# Altium schematic sheet caton-d-q100.SchDoc: Caton-D-Q100
size A4; SheetNumber: 1; SheetTotal: 1
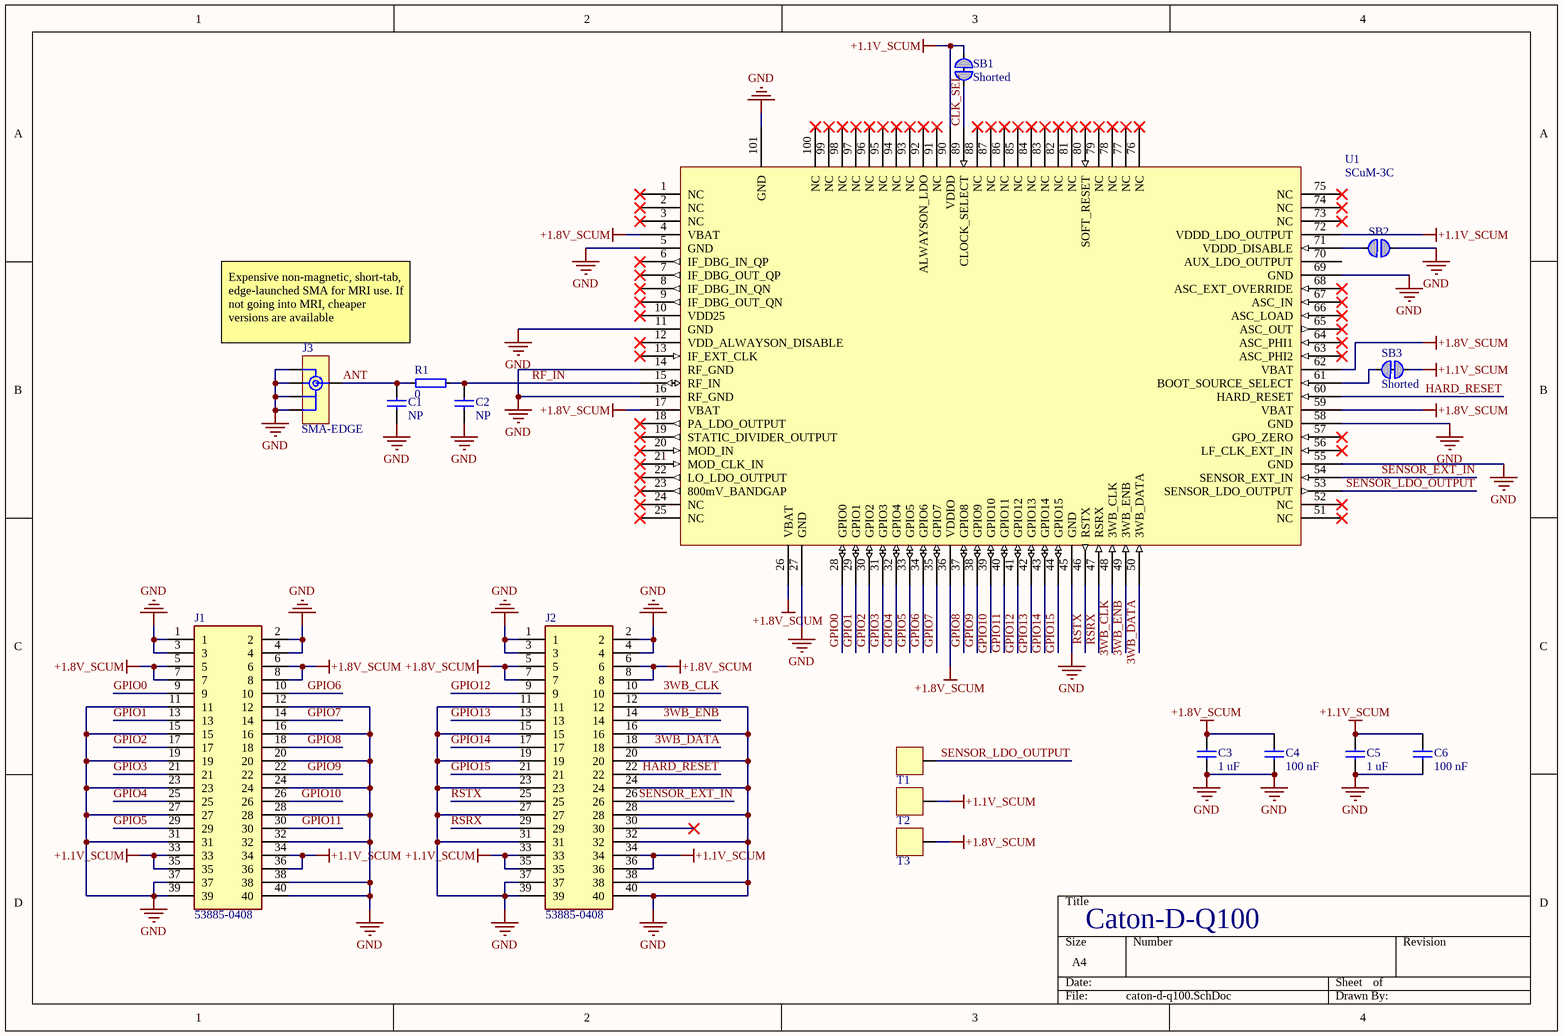
[diagram p0: caton-d-q100.SchDoc]

## Parts
C1  NP  [0603]
C2  NP  [0603]
C3  1 uF  [0603]
C4  100 nF  [0603]
C5  1 uF  [0603]
C6  100 nF  [0603]
J1  53885-0408  [538850408]
J2  53885-0408  [538850408]
J3  SMA-EDGE  [RF2-143-T-17-50-G]
R1  0  [0603]
SB1  Shorted  [Solderbridge_Shorted]  (net tie, no BOM)
SB2  Solderbridge  [Solderbridge]  (value not drawn)  (no BOM)
SB3  Shorted  [Solderbridge_Shorted]  (net tie, no BOM)
T1  TP_VIA  [TP_VIA_1MM]  (value not drawn)  (no BOM)
T2  TP_VIA  [TP_VIA_1MM]  (value not drawn)  (no BOM)
T3  TP_VIA  [TP_VIA_1MM]  (value not drawn)  (no BOM)
U1  SCuM-3C  [QFN40P1200X1200X100_HS-101N]

## Nets
+1.1V_SCUM: C5.2 C6.2 J1.33 J1.34 J1.35 J1.36 J2.33 J2.34 J2.35 J2.36 SB1.1 SB3.2 T2.1 U1.72(VDDD_LDO_OUTPUT) U1.90(VDDD)
+1.8V_SCUM: C3.2 C4.2 J1.5 J1.6 J1.7 J1.8 J2.5 J2.6 J2.7 J2.8 T3.1 U1.4(VBAT) U1.17(VBAT) U1.26(VBAT) U1.36(VDDIO) U1.59(VBAT) U1.62(VBAT)
GND: C1.1 C2.1 C3.1 C4.1 C5.1 C6.1 J1.1 J1.2 J1.3 J1.4 J1.11 J1.12 J1.15 J1.16 J1.19 J1.20 J1.23 J1.24 J1.27 J1.28 J1.31 J1.32 J1.37 J1.38 J1.39 J1.40 J2.1 J2.2 J2.3 J2.4 J2.11 J2.12 J2.15 J2.16 J2.19 J2.20 J2.23 J2.24 J2.27 J2.28 J2.31 J2.32 J2.37 J2.38 J2.39 J2.40 J3.2 J3.3 J3.4 J3.5 SB2.2 U1.5(GND) U1.11(GND) U1.14(RF_GND) U1.16(RF_GND) U1.27(GND) U1.45(GND) U1.55(GND) U1.58(GND) U1.69(GND) U1.101(GND)
3WB_CLK: J2.10 U1.48(3WB_CLK)
3WB_DATA: J2.18 U1.50(3WB_DATA)
3WB_ENB: J2.14 U1.49(3WB_ENB)
ANT: C1.2 J3.1 R1.1
CLK_SEL: SB1.2 U1.89(CLOCK_SELECT)
GPIO0: J1.9 U1.28(GPIO0)
GPIO1: J1.13 U1.29(GPIO1)
GPIO2: J1.17 U1.30(GPIO2)
GPIO3: J1.21 U1.31(GPIO3)
GPIO4: J1.25 U1.32(GPIO4)
GPIO5: J1.29 U1.33(GPIO5)
GPIO6: J1.10 U1.34(GPIO6)
GPIO7: J1.14 U1.35(GPIO7)
GPIO8: J1.18 U1.37(GPIO8)
GPIO9: J1.22 U1.38(GPIO9)
GPIO10: J1.26 U1.39(GPIO10)
GPIO11: J1.30 U1.40(GPIO11)
GPIO12: J2.9 U1.41(GPIO12)
GPIO13: J2.13 U1.42(GPIO13)
GPIO14: J2.17 U1.43(GPIO14)
GPIO15: J2.21 U1.44(GPIO15)
HARD_RESET: J2.22 U1.60(HARD_RESET)
RF_IN: C2.2 R1.2 U1.15(RF_IN)
RSRX: J2.29 U1.47(RSRX)
RSTX: J2.25 U1.46(RSTX)
SENSOR_EXT_IN: J2.26 U1.54(SENSOR_EXT_IN)
SENSOR_LDO_OUTPUT: T1.1 U1.53(SENSOR_LDO_OUTPUT)
NetSB2_1: SB2.1 U1.71(VDDD_DISABLE)
NetSB3_1: SB3.1 U1.61(BOOT_SOURCE_SELECT)

Not connected (* = marked no-connect by the designer): J2 30*; U1 1(NC)* 2(NC)* 3(NC)* 6(IF_DBG_IN_QP)* 7(IF_DBG_OUT_QP)* 8(IF_DBG_IN_QN)* 9(IF_DBG_OUT_QN)* 10(VDD25)* 12(VDD_ALWAYSON_DISABLE)* 13(IF_EXT_CLK)* 18(PA_LDO_OUTPUT)* 19(STATIC_DIVIDER_OUTPUT)* 20(MOD_IN)* 21(MOD_CLK_IN)* 22(LO_LDO_OUTPUT)* 23(800mV_BANDGAP)* 24(NC)* 25(NC)* 51(NC)* 52(NC)* 56(LF_CLK_EXT_IN)* 57(GPO_ZERO)* 63(ASC_PHI2)* 64(ASC_PHI1)* 65(ASC_OUT)* 66(ASC_LOAD)* 67(ASC_IN)* 68(ASC_EXT_OVERRIDE)* 70(AUX_LDO_OUTPUT) 73(NC)* 74(NC)* 75(NC)* 76(NC)* 77(NC)* 78(NC)* 79(NC)* 80(SOFT_RESET)* 81(NC)* 82(NC)* 83(NC)* 84(NC)* 85(NC)* 86(NC)* 87(NC)* 88(NC)* 91(NC)* 92(ALWAYSON_LDO)* 93(NC)* 94(NC)* 95(NC)* 96(NC)* 97(NC)* 98(NC)* 99(NC)* 100(NC)*

## Notes on the sheet
- Expensive non-magnetic, short-tab, edge-launched SMA for MRI use. If not going into MRI, cheaper versions are available
- Caton-D-Q100

## Library data of the parts
C1-C6 = C0603: Capacitor, 0603, X5R, ±10%; Part Number: C0603-4µ7; Manufacturer: N.A.; Part number IPS: 00000007783; Note: 6.3V; Artikkelnr Noca: 20069060; Pad Count: 2; Manufacturer Part Number: N.A.; LatestRevisionDate: 2009-11-23; Published: 2009-05-08; Footprint Doc: 0603; ComponentLink1Description: Datasheet; ComponentLink1URL: N.A.; ComponentLink2Description: Supplier link; ComponentLink2URL: N.A.; HelpURL: N.A.; Supplier 1: N.A.; Supplier Part Number 1: N.A.; Supplier 2: N.A.; Supplier Part Number 2: N.A.; PartId: 100200274; Component Class: Capacitors; Author: rsk; Part number Norautron: N.A.
  C1 C2: Value: NP
  C3 C5: Value: 1 uF
  C4 C6: Value: 100 nF
J1 J2 = 53885-0408: 0.50mm Pitch SlimStack Plug, Surface Mount, Dual Row, Vertical, 2.50mm Stack Height, without Solder Tab, 40 Circuits; Manufacturer_Name: Molex; System: Connector; Datasheet Link: https://componentsearchengine.com/Datasheets/1/53885-0408.pdf; Height: 1.68mm; Manufacturer_Part_Number: 53885-0408; Mouser Part Number: 538-53885-0408; Mouser Price/Stock: https://www.mouser.co.uk/ProductDetail/Molex/53885-0408?qs=OdNwOVlk5%2FhjFAQwfbus0w%3D%3D
J3 = SMA-EDGE: Non-Magnetic / CONN SMA JACK STR 50OHM EDGE MNT
R1 = R0603: Resistor, 0603; Part Number: R0201-10k; Manufacturer: N.A.; Part number IPS: 00000001255; Note: Chip Res 1%; Pad Count: 2; Manufacturer Part Number: N.A.; LatestRevisionDate: 2014-11-13; Published: 2014-11-13; Value: 0; Artikkelnr Noca: N.A.; Footprint Doc: 0201; ComponentLink1Description: Datasheet; ComponentLink1URL: N.A.; ComponentLink2Description: Supplier link; ComponentLink2URL: N.A.; HelpURL: N.A.; Supplier 1: N.A.; Supplier Part Number 1: N.A.; Supplier 2: N.A.; Supplier Part Number 2: N.A.; PartId: 100100065; Component Class: Resistors; Author: rsk; Part number Norautron: N.A.
SB1 SB3 = Solderbridge Shorted: Shorted Solderbridge; Manufacturer: N.A.; Pad Count: 2; Part Number: Solderbridge Shorted; Manufacturer Part Number: N.A.; Footprint Doc: Solderbridge_Shorted; LatestRevisionDate: 2012-08-07; Published: 2012-08-07; Value: Shorted; Note: N.A.; Artikkelnr Noca: N.A.; Part number IPS: N.A.; ComponentLink1Description: Datasheet; ComponentLink1URL: N.A.; ComponentLink2Description: Supplier link; ComponentLink2URL: N.A.; HelpURL: N.A.; Supplier 1: N.A.; Supplier Part Number 1: N.A.; Supplier 2: N.A.; Supplier Part Number 2: N.A.; PartId: 100500459; Component Class: Connectors; Author: rsk; Part number Norautron: N.A.
SB2 = Solderbridge: Manufacturer: N.A.; Pad Count: 2; Part Number: Solderbridge; Manufacturer Part Number: N.A.; Footprint Doc: Solderbridge; LatestRevisionDate: 2009-12-14; Published: 2009-12-14; Value: Solderbridge; Note: N.A.; Artikkelnr Noca: N.A.; Part number IPS: N.A.; ComponentLink1Description: Datasheet; ComponentLink1URL: N.A.; ComponentLink2Description: Supplier link; ComponentLink2URL: N.A.; HelpURL: N.A.; Supplier 1: N.A.; Supplier Part Number 1: N.A.; Supplier 2: N.A.; Supplier Part Number 2: N.A.; PartId: 100500458; Component Class: Connectors; Author: rsk; Part number Norautron: N.A.
T1-T3 = TP_VIA: Test point 1 pin